# Altium schematic sheet SeniorDesignPCB.SchDoc
size A
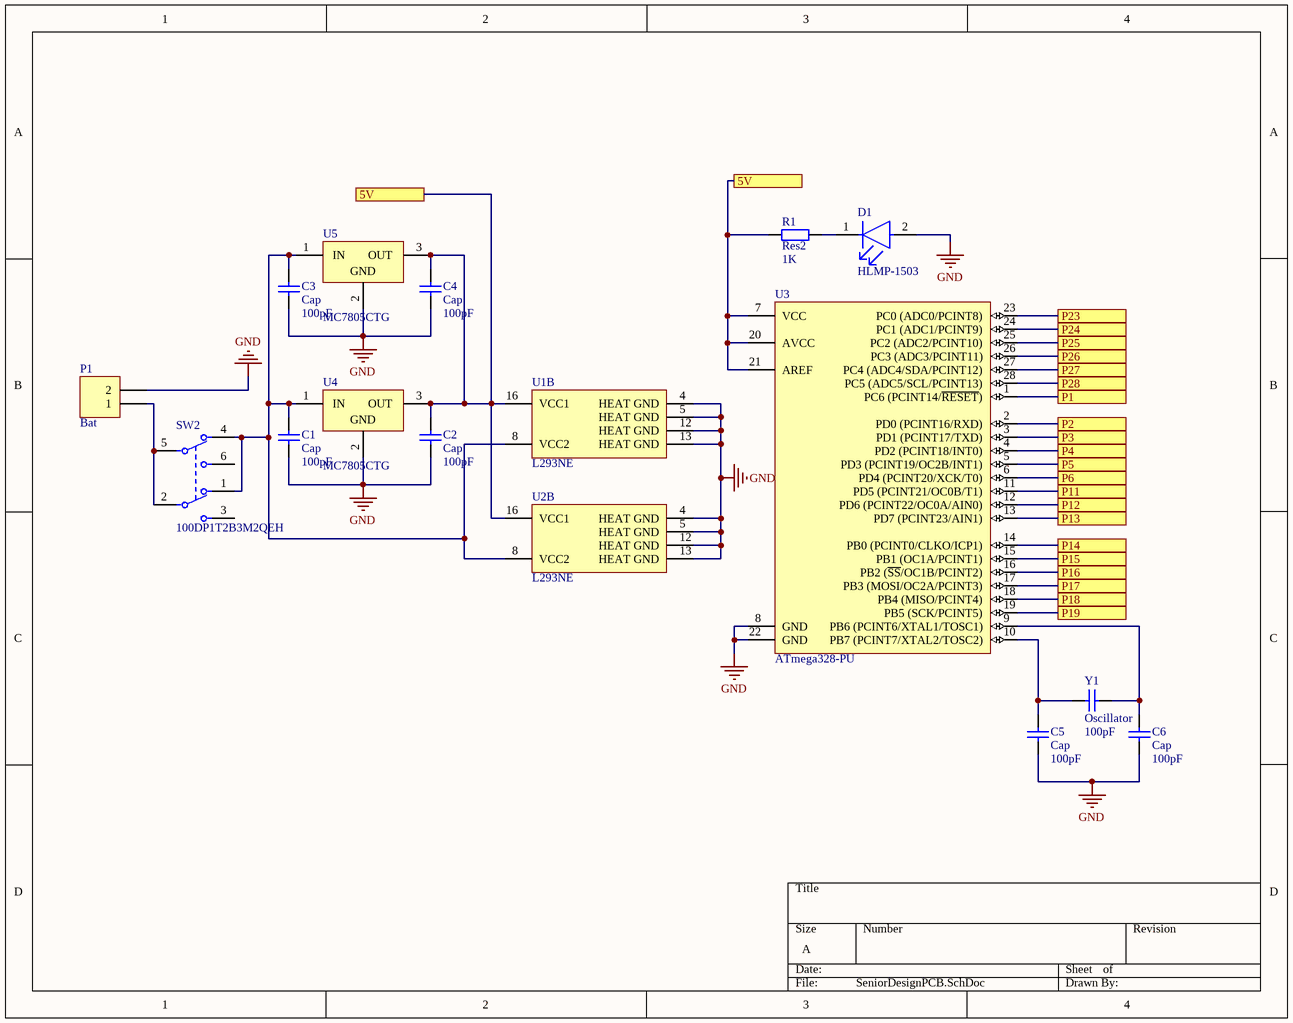
[diagram p0: SeniorDesignPCB.SchDoc]

## Parts
C1  Cap  value 100pF  [RAD-0.3]
C2  Cap  value 100pF  [RAD-0.3]
C3  Cap  value 100pF  [RAD-0.3]
C4  Cap  value 100pF  [RAD-0.3]
C5  Cap  value 100pF  [RAD-0.3]
C6  Cap  value 100pF  [RAD-0.3]
D1  HLMP-1503  [FP-HLMP-1503-MFG]
P1  Bat  [HDR1X2]
R1  Res2  value 1K  [AXIAL-0.4]
SW2  100DP1T2B3M2QEH  [FP-100DP1T2B3M2QEH-MFG]
U1  L293NE  [NE0016A]  (part B of 2)
U2  L293NE  [NE0016A]  (part B of 2)
U3  ATmega328-PU  [28P3]
U4  MC7805CTG  [ONSC-TO-220-3-221AB-01]
U5  MC7805CTG  [ONSC-TO-220-3-221AB-01]
Y1  Oscillator  value 100pF  [RAD-0.3]

## Ports
5V, P1, P2, P3, P4, P5, P6, P11, P12, P13, P14, P15, P16, P17, P18, P19, P23, P24, P25, P26, P27, P28

## Nets
GND: C1.1 C2.1 C3.1 C4.1 C5.1 C6.1 D1.2(A) P1.2 U1.4(HEAT_GND) U1.5(HEAT_GND) U1.12(HEAT_GND) U1.13(HEAT_GND) U2.4(HEAT_GND) U2.5(HEAT_GND) U2.12(HEAT_GND) U2.13(HEAT_GND) U3.8(GND) U3.22(GND) U4.2(GND) U5.2(GND)
5V: C2.2 C4.2 R1.1 U1.16(VCC1) U2.16(VCC1) U3.7(VCC) U3.20(AVCC) U3.21(AREF) U4.3(OUT) U5.3(OUT) ; port 5V
P1: U3.1(PC6_(PCINT14/~{RESET})) ; port P1
P2: U3.2(PD0_(PCINT16/RXD)) ; port P2
P3: U3.3(PD1_(PCINT17/TXD)) ; port P3
P4: U3.4(PD2_(PCINT18/INT0)) ; port P4
P5: U3.5(PD3_(PCINT19/OC2B/INT1)) ; port P5
P6: U3.6(PD4_(PCINT20/XCK/T0)) ; port P6
P11: U3.11(PD5_(PCINT21/OC0B/T1)) ; port P11
P12: U3.12(PD6_(PCINT22/OC0A/AIN0)) ; port P12
P13: U3.13(PD7_(PCINT23/AIN1)) ; port P13
P14: U3.14(PB0_(PCINT0/CLKO/ICP1)) ; port P14
P15: U3.15(PB1_(OC1A/PCINT1)) ; port P15
P16: U3.16(PB2_(~{SS}/OC1B/PCINT2)) ; port P16
P17: U3.17(PB3_(MOSI/OC2A/PCINT3)) ; port P17
P18: U3.18(PB4_(MISO/PCINT4)) ; port P18
P19: U3.19(PB5_(SCK/PCINT5)) ; port P19
P23: U3.23(PC0_(ADC0/PCINT8)) ; port P23
P24: U3.24(PC1_(ADC1/PCINT9)) ; port P24
P25: U3.25(PC2_(ADC2/PCINT10)) ; port P25
P26: U3.26(PC3_(ADC3/PCINT11)) ; port P26
P27: U3.27(PC4_(ADC4/SDA/PCINT12)) ; port P27
P28: U3.28(PC5_(ADC5/SCL/PCINT13)) ; port P28
NetC1_2: C1.2 C3.2 SW2.1 SW2.4 U1.8(VCC2) U2.8(VCC2) U4.1(IN) U5.1(IN)
NetC5_2: C5.2 U3.10(PB7_(PCINT7/XTAL2/TOSC2)) Y1.2
NetC6_2: C6.2 U3.9(PB6_(PCINT6/XTAL1/TOSC1)) Y1.1
NetD1_1: D1.1(C) R1.2
NetP1_1: P1.1 SW2.2 SW2.5

Not connected (* = marked no-connect by the designer): SW2 3 6

## Library data of the parts
C1-C4 = Cap: Capacitor 10 uF; Published: 8-Jun-2000; LatestRevisionDate: 17-Jul-2002; LatestRevisionNote: Re-released for DXP Platform.; PackageReference: RAD-0.3; Publisher: Altium Limited; PackageDescription: Radial Cap, Thru-Hole; 2 Leads; 0.3 in Pin Spacing
C5 C6 = Cap: Capacitor 22 pF; Published: 8-Jun-2000; LatestRevisionDate: 17-Jul-2002; LatestRevisionNote: Re-released for DXP Platform.; PackageReference: RAD-0.3; Publisher: Altium Limited; PackageDescription: Radial Cap, Thru-Hole; 2 Leads; 0.3 in Pin Spacing
D1 = CMP-18399-000010-1: LED GREEN DIFFUSED T-1 T/H; Manufacturer: Broadcom; Reverse Voltage: 5V; Wavelength: 569nm; Forward Voltage: 2.1V; Led Orientation: Straight; Viewing Angle: 60°; Max Junction Temp: +110°C; Peak Emmision Wavelength: 565nm; Luminous Intensity: 1mcd; Standoff Height: 0.88mm; Forward Current: 10mA; Mouser Description: LED; Green; 1mcd; 0.115In.Dia.; T-1; 565nm; 25mA; 2.1V; 5V; GaP; -20degC; 100deg; ComponentLink2Description: Datasheet; Digikey Description: LED GREEN DIFFUSED T-1 T/H; Device Class L1: Optoelectronics; Device Class L3: unset; Automotive: No; Device Class L2: LEDs; Manufacturer Part Number: HLMP-1503; Category: Diode; Temperature Range Low: -20°C; Height: 6.35mm; RoHS: TRUE; Octopart: https://octopart.com/hlmp-1503-broadcom-71130371; Temperature: -20°C to +100°C; Lead Free: Yes; ComponentLink2URL: https://docs.broadcom.com/docs/AV02-1555EN; Package: HLMP-1503; Colour: Green; Temperature Range High: +100°C
P1 = Header 2: Header, 2-Pin; LatestRevisionDate: 17-Jul-2002; LatestRevisionNote: Re-released for DXP Platform.; Publisher: Altium Limited
R1 = Res2: Resistor 220 ohm; Published: 8-Jun-2000; LatestRevisionDate: 17-Jul-2002; LatestRevisionNote: Re-released for DXP Platform.; PackageReference: AXIAL-0.4; Publisher: Altium Limited; PackageDescription: Axial Device, Thru-Hole; 2 Leads; 0.4 in Pin Spacing
SW2 = CMP-17880-000002-1: SWITCH TOGGLE NON ILLUMINATED; Manufacturer: E-Switch; Contact Current Rating: 5A; Electromechanical Life: 40000Cycles; Contact Resistance: 10mΩ; Description: DPDT Toggle Switch; Voltage Rating Ac: 120V; Throw Configuration: DPDT; Voltage Rating Dc: 28V; ComponentLink2Description: Datasheet; Height: 23.6mm; Temperature Range Low: -30°C; RoHS: TRUE; Package: 0; Category: Switch; Mouser Description: Toggle Switches 5A 120VAC/28VDC On-None-On PC Mnt; ComponentLink2URL: http://spec_sheets.e-switch.com/specs/ST121094.pdf; Lead Free: Yes; Device Class L2: Switches; Digikey Description: SWITCH TOGGLE NON ILLUMINATED; Temperature: -30°C to +85°C; Footprint Url: http://spec_sheets.e-switch.com/specs/ST121094.pdf; Automotive: No; Temperature Range High: +85°C; Device Class L3: Toggle Switches; Octopart: https://octopart.com/100dp1t2b3m2qeh-e-switch-7054946; Manufacturer Part Number: 100DP1T2B3M2QEH; Mount: Through Hole; Device Class L1: Electromechanical
U1 U2 = CMP-2000-04965-1: Quadruple Half-H Driver, 4.5 to 36 V, 0 to 70 degC, 16-Pin DIP, Pb-Free, Tube; Manufacturer: Texas Instruments; Rad Hard: No; Package Version: 4040054/B, 04/1995; Maximum Operating Current: 24mA; Packaging: Rail/Tube; Mounting: ThroughHole; Manufacturer URL: http://www.ti.com/; Type: 4-ChannelMotorDriver; Datasheet Version: Rev. D, 01/2016; Package Reference: NE16; Operating Temperature: 0to70degC; Package: 16PDIP; Package Description: 16-Pin Plastic Dual-In-Line Package, Body 19.8 x 6.35 mm, Pitch 2.54 mm; Category: MotionMotorControl; Datasheet URL: http://www.ti.com/general/docs/lit/getliterature.tsp?genericPartNumber=l293d&fileType=pdf; Package URL: http://www.ti.com/litv/pdf/mpdi003
U3 = CMP-0095-00015-2: 8-bit AVR Microcontroller, 32KB Flash, 1KB EEPROM, 2KB SRAM, 28-pin PDIP, Industrial Grade (-40°C to 85°C); ComponentLink3Description: ATmega48A/48PA/88A/88PA/168A/168PA/328/328P Summary; RevisionNote: DatasheetVersion updated. URLs added.; DatasheetVersion: revD, May-2011; ComponentLink1URL: http://www.atmel.com/; PackageVersion: revB, Sep-2001; PackageDescription: 28-lead (0.300"/7.62mm Wide) Plastic Dual Inline Package (PDIP); PackageReference: 28P3; ComponentLink1Description: Manufacturer URL; ComponentLink2Description: ATmega48A/48PA/88A/88PA/168A/168PA/328/328P Datasheet; ComponentLink3URL: http://www.atmel.com/dyn/resources/prod_documents/8271S.pdf; ComponentLink2URL: http://www.atmel.com/dyn/resources/prod_documents/8271.pdf
U4 U5 = CMP-2000-04928-1: Positive Voltage Regulator, 1 A, 5 V, 0 to 125 degC, 3-Pin TO-220, RoHS, Tube; Manufacturer: ON Semiconductor; Resistance, Thermal, Junction to Case: 5degC/W; Voltage, Supply: 35V; Regulator Function: Standard; Temperature, Operating, Maximum: +125degC; Load Regulation: 25mV; Regulator Type: PositiveVoltageOut; Current, Output, Maximum: 1A; Regulation, Load: 1.3mV; Number of Outputs: 1; Temperature, Operating, Range: 0to+125degC; Regulation, Line: 0.5mV; Line Regulation: 20mV; Voltage, Input Range: Maximumof35V; Output Type: Fixed; Current, Quiescent Supply: 6.5mA; Dropout Voltage: 2V; Temperature, Operating, Minimum: 0degC; Package Version: Rev. A, 11/2010; Current, Supply: 3.2mA; Voltage, Output: 5V; Voltage, Noise: 10μV/V; Package Type: TO-220; Voltage, Input, High Level: 35V; Datasheet URL: http://www.onsemi.com/pub_link/Collateral/MC7800-D.PDF; Dimensions: 10.28x4.82x15.75mm; Width: 4.82mm; Type: VoltageRegulator; Mounting Type: ThroughHole; Polarity: Positive; Datasheet Version: Rev. 27, 11/2014; Height: 15.75mm; Dropout Voltage Measurement Current: 1A; Package Description: 3-Pin Flange Mount, Vertical Straight Lead, Body 9.97 x 4.445 mm, Pitch 2.54 mm; Manufacturer URL: http://www.onsemi.com/; Voltage, Dropout: 2V; Length: 10.28mm; Number of Pins: 3; Package Reference: TO-220-3-221AB-01
Y1 = Cap: 16 MHz oscillator; Published: 8-Jun-2000; LatestRevisionDate: 17-Jul-2002; LatestRevisionNote: Re-released for DXP Platform.; PackageReference: RAD-0.3; Publisher: Altium Limited; PackageDescription: Radial Cap, Thru-Hole; 2 Leads; 0.3 in Pin Spacing